# EAGLE schematic ts-w5500 (EAGLE 9.6.2)
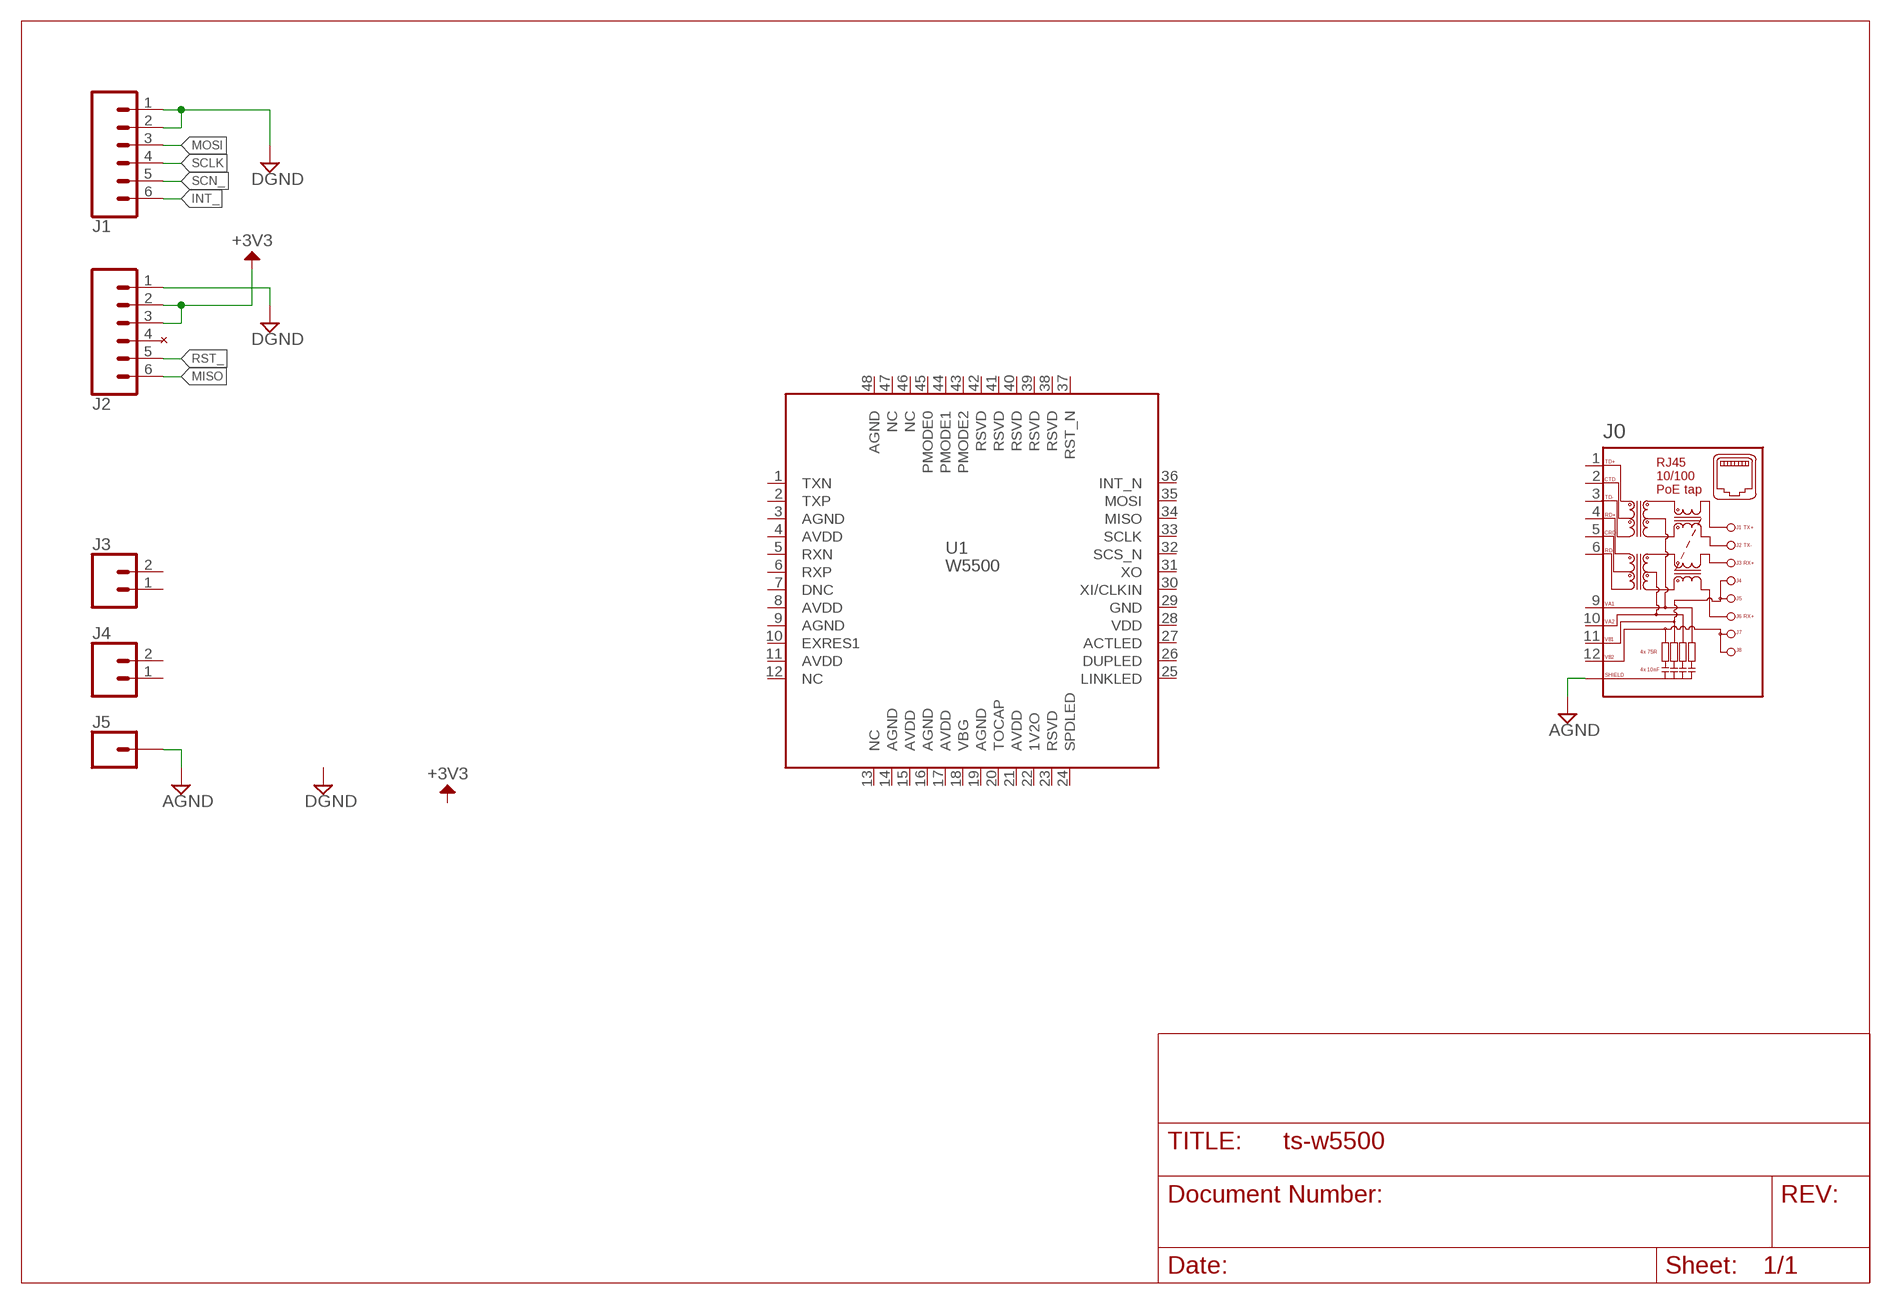
[diagram p0: schematic, sheet 1]

## Parts
J0  7498210003  [SMD_7498210003]
J1  CONN_06NO_SILK_NO_POP  [1X06_NO_SILK]
J2  CONN_06NO_SILK_NO_POP  [1X06_NO_SILK]
J3  CONN_021X02_NO_SILK  [1X02_NO_SILK]
J4  CONN_021X02_NO_SILK  [1X02_NO_SILK]
J5  CONN_01  [1X01]
U1  W5500  [W5500]

## Nets
+3V3: J2.2 J2.3
AGND: J0.13(SHIELD) J0.14(SHIELD) J5.1
DGND: J1.1 J1.2 J2.1
INT_: J1.6
MISO: J2.6
MOSI: J1.3
RST_: J2.5
SCLK: J1.4
SCN_: J1.5
Unconnected: J0.1 J0.2 J0.3 J0.4 J0.5 J0.6 J0.9 J0.10 J0.11 J0.12 J2.4 J3.1 J3.2 J4.1 J4.2 U1.1(TXN) U1.2(TXP) U1.3(AGND) U1.4(AVDD) U1.5(RXN) U1.6(RXP) U1.7(DNC) U1.8(AVDD) U1.9(AGND) U1.10(EXRES1) U1.11(AVDD) U1.12(NC) U1.13(NC) U1.14(AGND) U1.15(AVDD) U1.16(AGND) U1.17(AVDD) U1.18(VBG) U1.19(AGND) U1.20(TOCAP) U1.21(AVDD) U1.22(1V2O) U1.23(RSVD) U1.24(SPDLED) U1.25(LINKLED) U1.26(DUPLED) U1.27(ACTLED) U1.28(VDD) U1.29(GND) U1.30(XI/CLKIN) U1.31(XO) U1.32(SCS_N) U1.33(SCLK) U1.34(MISO) U1.35(MOSI) U1.36(INT_N) U1.37(RST_N) U1.38(RSVD) U1.39(RSVD) U1.40(RSVD) U1.41(RSVD) U1.42(RSVD) U1.43(PMODE2) U1.44(PMODE1) U1.45(PMODE0) U1.46(NC) U1.47(NC) U1.48(AGND)

## Library data of the parts
J0 = 7498210003:7498210003
J1 J2 = SparkFun-Connectors:CONN_06: Multi connection point. Often used as Generic Header-pin footprint for 0.1 inch spaced/style header connections On any of the 0.1 inch spaced packages, you can populate with these: Break Away Headers - Straight <https://www.sparkfun.com/products/116> (PRT-00116) Break Away Male Headers - Right Angle <https://www.sparkfun.com/products/553> (PRT-00553) Female Headers <https://www.sparkfun.com/products/115> (PRT-00115) Break Away Headers - Machine Pin <https://www.sparkfun.com/products/117> (PRT-00117) Break Away Female Headers - Swiss Machine Pin <https://www.sparkfun.com/products/743> (PRT-00743) Arduino Stackable Header - 6 Pin <https://www.sparkfun.com/products/9280> (PRT-09280) Screw Terminals 2.54mm Pitch (6-Pin) <https://www.sparkfun.com/products/16499> (PRT-16499) For SCREWTERMINALS and SPRING TERMINALS visit here: Screw Terimnals on SparkFun.com <https://www.sparkfun.com/search/results?term=Screw+Terminals> (5mm/3.5mm/2.54mm spacing) This device is also useful as a general connection point to wire up your design to another part of your project. Our various solder wires solder well into these plated through hole pads. Hook-Up Wire - Assortment (Stranded, 22 AWG) <https://www.sparkfun.com/products/11375> (PRT-11375) Hook-Up Wire - Assortment (Solid Core, 22 AWG) <https://www.sparkfun.com/products/11367> (PRT-11367) View the entire wire category on our website here <https://www.sparkfun.com/categories/141>
J3 J4 = SparkFun-Connectors:CONN_02: Multi connection point. Often used as Generic Header-pin footprint for 0.1 inch spaced/style header connections On any of the 0.1 inch spaced packages, you can populate with these: Break Away Headers - Straight <https://www.sparkfun.com/products/116> (PRT-00116) Break Away Male Headers - Right Angle <https://www.sparkfun.com/products/553> (PRT-00553) Female Headers <https://www.sparkfun.com/products/115> (PRT-00115) Break Away Headers - Machine Pin <https://www.sparkfun.com/products/117> (PRT-00117) Break Away Female Headers - Swiss Machine Pin <https://www.sparkfun.com/products/743> (PRT-00743) For SCREWTERMINALS and SPRING TERMINALS visit here: Screw Terimnals on SparkFun.com <https://www.sparkfun.com/search/results?term=Screw+Terminals> (5mm/3.5mm/2.54mm spacing) This device is also useful as a general connection point to wire up your design to another part of your project. Our various solder wires solder well into these plated through hole pads. Hook-Up Wire - Assortment (Stranded, 22 AWG) <https://www.sparkfun.com/products/11375> (PRT-11375) Hook-Up Wire - Assortment (Solid Core, 22 AWG) <https://www.sparkfun.com/products/11367> (PRT-11367) View the entire wire category on our website here <https://www.sparkfun.com/categories/141> Special notes: Molex polarized connector foot print use with: PRT-08233 with associated crimp pins and housings. 2.54_SCREWTERM for use with PRT-10571. 3.5mm Screw Terminal footprints for PRT-08084 5mm Screw Terminal footprints for use with PRT-08432
J5 = SparkFun-Connectors:CONN_01: Single connection point. Often used as Generic Header-pin footprint for 0.1 inch spaced/style header connections On any of the 0.1 inch spaced packages, you can populate with these: Break Away Headers - Straight <https://www.sparkfun.com/products/116> (PRT-00116) Break Away Male Headers - Right Angle <https://www.sparkfun.com/products/553> (PRT-00553) Female Headers <https://www.sparkfun.com/products/115> (PRT-00115) Break Away Headers - Machine Pin <https://www.sparkfun.com/products/117> (PRT-00117) Break Away Female Headers - Swiss Machine Pin <https://www.sparkfun.com/products/743> (PRT-00743) This device is also useful as a general connection point to wire up your design to another part of your project. Our various solder wires solder well into these plated through hole pads. Hook-Up Wire - Assortment (Stranded, 22 AWG) <https://www.sparkfun.com/products/11375> (PRT-11375) Hook-Up Wire - Assortment (Solid Core, 22 AWG) <https://www.sparkfun.com/products/11367> (PRT-11367) View the entire wire category on our website here <https://www.sparkfun.com/categories/141> Special notes: SMTSO-256-ET is a "flush mount" nut for a 4-40 screw. We mostly use this on specialty testbeds; it is a nice way to connect hardware to your PCB at an adjustable hieght. Also note, the SNAP packages are for using a snappable style connector. We sell a baggie of snaps and they are also used on two LilyPad designs: Snap Assortment - 30 pack (male and female) <https://www.sparkfun.com/products/11347> (DEV-11347) LilyPad Arduino SimpleSnap <https://www.sparkfun.com/products/10941> (DEV-10941) LilyPad SimpleSnap Protoboard <https://www.sparkfun.com/products/10940> (DEV-10940)
U1 = W5500:W5500